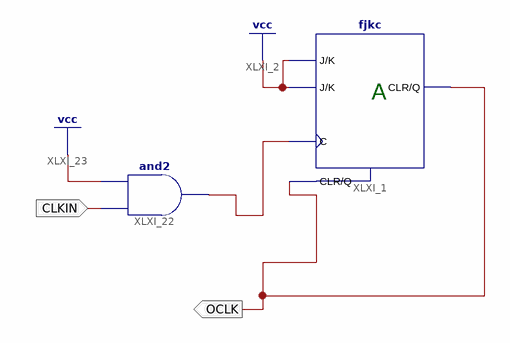
[diagram p0: schematic sheet 1]
// Xilinx ISE schematic Mod2.sch (spartan6) as structural Verilog: 2 symbols, 2 ports
module Mod2 (
  input  CLKIN,
  output OCLK
);

  wire XLXN_42;

  fjkc XLXI_1 (.C(XLXN_42), .CLR(OCLK), .J(1'b1), .K(1'b1), .Q(OCLK));
  and XLXI_22 (XLXN_42, CLKIN, 1'b1);

  // Notes on the sheet:
  //   A
endmodule
